# Altium schematic sheet Heater_ADC.SchDoc
size OrCAD A
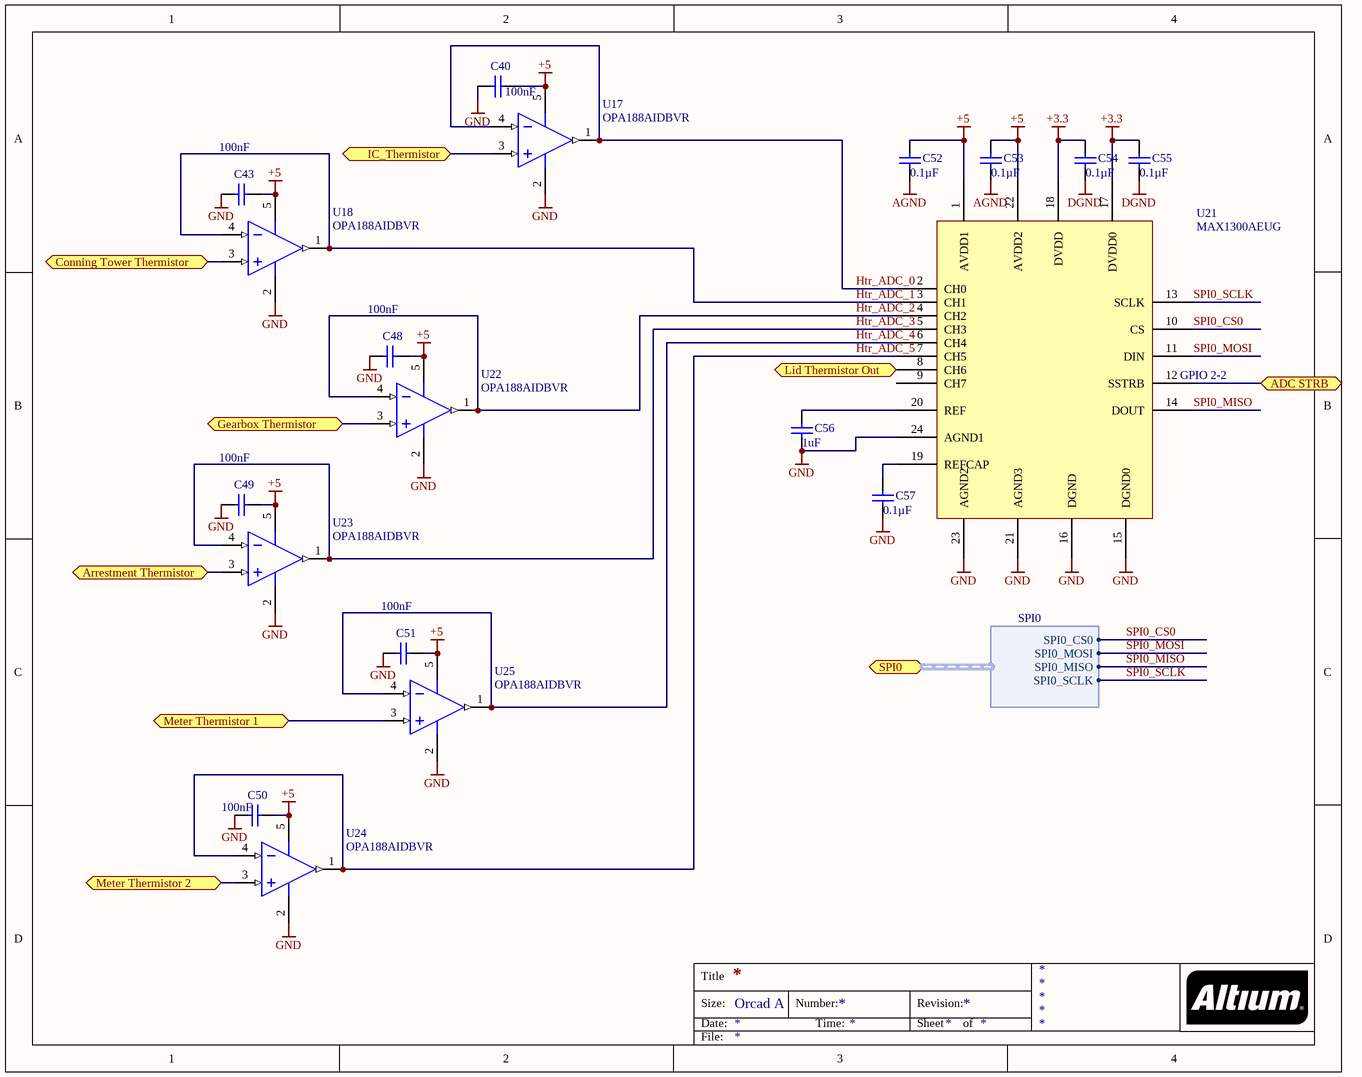
[diagram p0: Heater_ADC.SchDoc]

## Parts
C40  Capacitance: 100nF  [CAPC0402(1005)60_L]
C43  Capacitance: 100nF  [CAPC0402(1005)60_L]
C48  Capacitance: 100nF  [CAPC0402(1005)60_L]
C49  Capacitance: 100nF  [CAPC0402(1005)60_L]
C50  Capacitance: 100nF  [CAPC0402(1005)60_L]
C51  Capacitance: 100nF  [CAPC0402(1005)60_L]
C52  Capacitance: 0.1µF  [CAPC0805(2012)145_N]  (hidden comment: CAP CER 0.1UF 25V X7R 0805)
C53  Capacitance: 0.1µF  [CAPC0805(2012)145_N]  (hidden comment: CAP CER 0.1UF 25V X7R 0805)
C54  Capacitance: 0.1µF  [CAPC0805(2012)145_N]  (hidden comment: CAP CER 0.1UF 25V X7R 0805)
C55  Capacitance: 0.1µF  [CAPC0805(2012)145_N]  (hidden comment: CAP CER 0.1UF 25V X7R 0805)
C56  Capacitance: 1uF  [CAPC0805(2012)145_N]  (hidden comment: CAP CER 1UF 16V X7R 0805)
C57  Capacitance: 0.1µF  [CAPC0805(2012)145_N]  (hidden comment: CAP CER 0.1UF 16V X7R 0805)
U17  OPA188AIDBVR  [DBV0005A_M]
U18  OPA188AIDBVR  [DBV0005A_M]
U21  MAX1300AEUG  [TSOP65P640X90-24N]
U22  OPA188AIDBVR  [DBV0005A_M]
U23  OPA188AIDBVR  [DBV0005A_M]
U24  OPA188AIDBVR  [DBV0005A_M]
U25  OPA188AIDBVR  [DBV0005A_M]

## Ports
ADC STRB, Arrestment Thermistor, Conning Tower Thermistor, Gearbox Thermistor, IC_Thermistor, Lid Thermistor Out, Meter Thermistor 1, Meter Thermistor 2, SPI0 (harness SPI0)

## Harnesses
SPI0: SPI0_CS0, SPI0_MOSI, SPI0_MISO, SPI0_SCLK

## Nets
+3.3: C54.1 C55.1 U21.17(DVDD0) U21.18(DVDD)
+5: C40.2 C43.2 C48.2 C49.2 C50.2 C51.2 C52.1 C53.1 U17.5(V+) U18.5(V+) U21.1(AVDD1) U21.22(AVDD2) U22.5(V+) U23.5(V+) U24.5(V+) U25.5(V+)
AGND: C52.2 C53.2
DGND: C54.2 C55.2
GND: C40.1 C43.1 C48.1 C49.1 C50.1 C51.1 C56.2 C57.2 U17.2(V-) U18.2(V-) U21.15(DGND0) U21.16(DGND) U21.21(AGND3) U21.23(AGND2) U21.24(AGND1) U22.2(V-) U23.2(V-) U24.2(V-) U25.2(V-)
ADC STRB: U21.12(SSTRB) ; port ADC STRB
Arrestment Thermistor: U23.3(IN+) ; port Arrestment Thermistor
Conning Tower Thermistor: U18.3(IN+) ; port Conning Tower Thermistor
Gearbox Thermistor: U22.3(IN+) ; port Gearbox Thermistor
Htr_ADC_0: U17.1(OUT) U17.4(IN-) U21.2(CH0)
Htr_ADC_1: U18.1(OUT) U18.4(IN-) U21.3(CH1)
Htr_ADC_2: U21.4(CH2) U22.1(OUT) U22.4(IN-)
Htr_ADC_3: U21.5(CH3) U23.1(OUT) U23.4(IN-)
Htr_ADC_4: U21.6(CH4) U25.1(OUT) U25.4(IN-)
Htr_ADC_5: U21.7(CH5) U24.1(OUT) U24.4(IN-)
IC_Thermistor: U17.3(IN+) ; port IC_Thermistor
Lid Thermistor Out: U21.8(CH6) ; port Lid Thermistor Out
Meter Thermistor 1: U25.3(IN+) ; port Meter Thermistor 1
Meter Thermistor 2: U24.3(IN+) ; port Meter Thermistor 2
SPI0_CS0: U21.10(CS) ; port SPI0.SPI0_CS0
SPI0_MISO: U21.14(DOUT) ; port SPI0.SPI0_MISO
SPI0_MOSI: U21.11(DIN) ; port SPI0.SPI0_MOSI
SPI0_SCLK: U21.13(SCLK) ; port SPI0.SPI0_SCLK
NetC56_1: C56.1 U21.20(REF)
NetC57_1: C57.1 U21.19(REFCAP)

Not connected (* = marked no-connect by the designer): U21 9(CH7)

## Notes on the sheet
- (near U21) GPIO 2-2
- Title
- Size:
- Date:
- Orcad A
- Number:
- Time:
- Revision:
- Sheet
- of
- File:

## Library data of the parts
C40 C43 C48-C51 = CMP-1034-01343-1: Manufacturer: Kemet; Manufacturer Part Number: C0402C104K4RACAUTO; Dielectric Material: Ceramic; Tolerance: 10%; Voltage Rating: 16V; Dielectric: X7R; Dissipation Factor: 3.5%; Supplier 1: Mouser; Supplier Part Number 1: 80-C0402C104K4RAUTO; Stock 1: 120173; Pricing 1: 1=0.1, 10=0.07, 50=0.07, 100=0.07, 1000=0.059, 10000=0.042 (USD); Mount: Surface Mount; Case/Package: 0402; Case Code (Imperial): 0402; Case Code (Metric): 1005; Min Operating Temperature: -55°C; Max Operating Temperature: 125°C; Packaging: Tape and Reel; Package Quantity: 10000; Voltage Rating (DC): 16V; Termination: SMD/SMT; Length: 1mm; Height: 0.5mm; Width: 0.5mm; Thickness: 0.022inch; Depth: 0.5mm; Radiation Hardening: No; REACH SVHC: No SVHC; ComponentLink1URL: https://datasheet.ciiva.com/6254/datasheetpn-c0402c104k4racauto-6254625.pdf; ComponentLink1Description: https://datasheet.ciiva.com/6254/datasheetpn-c0402c104k4racauto-6254625.pdf; ComponentLink2URL: https://datasheet.ciiva.com/5999/1730444-5999370.pdf; ComponentLink2Description: https://datasheet.ciiva.com/5999/1730444-5999370.pdf; ComponentLink3URL: https://datasheet.ciiva.com/7747/1730444-7747437.pdf; ComponentLink3Description: https://datasheet.ciiva.com/7747/1730444-7747437.pdf; ComponentLink4URL: https://datasheet.ciiva.com/22693/1730444-22693870.pdf; ComponentLink4Description: https://datasheet.ciiva.com/22693/1730444-22693870.pdf
C52-C55 = CMP-1036-04795-1: Manufacturer: Murata Electronics North America; Manufacturer Part Number: GRM21BR71E104KA01L; Tolerance: ±10%; Supplier 1: Digi-Key; Supplier Part Number 1: 490-1673-6-ND; RoHS: RoHS Compliant; Category: Capacitors; Stock 1: 891652; Pricing 1: 1=0.2, 10=0.145, 100=0.0683, 500=0.04788, 1000=0.03964 (USD); Packaging: Digi-Reel®; Part Status: Active; Voltage - Rated: 25V; Temperature Coefficient: X7R; Operating Temperature: -55°C ~ 125°C; Features: -; Ratings: -; Applications: General Purpose; Mounting Type: Surface Mount, MLCC; Package / Case: 0805 (2012 Metric); Size / Dimension: 0.079" L x 0.049" W (2.00mm x 1.25mm); Height - Seated (Max): -; Thickness (Max): 0.053" (1.35mm); Lead Spacing: -; Lead Style: -; ComponentLink1URL: http://www.murata.com/~/media/webrenewal/support/library/catalog/products/capacitor/mlcc/c02e.ashx; ComponentLink1Description: http://www.murata.com/~/media/webrenewal/support/library/catalog/products/capacitor/mlcc/c02e.ashx
C56 = CMP-1036-04795-1: Manufacturer: Kemet; Manufacturer Part Number: C0805X105K4RACTU; Dielectric Material: Ceramic; Tolerance: 10%; Dissipation Factor: 3.5%; Supplier 1: Digi-Key; Supplier Part Number 1: 399-5329-1-ND; Stock 1: 12821; Pricing 1: 1=0.72, 10=0.528, 100=0.3623, 500=0.2868, 1000=0.2415 (USD); Mount: Surface Mount; Case/Package: 0805; Case Code (Imperial): 0805; Case Code (Metric): 2012; Min Operating Temperature: -55°C; Max Operating Temperature: 125°C; Packaging: Tape and Reel; Voltage Rating (DC): 16V; Package Quantity: 1; Voltage Rating: 16V; Dielectric: X7R; Termination: SMD/SMT; Voltage: 16V; Length: 2.1mm; Height: 0.9mm; Width: 1.25mm; Thickness: 0.039inch; Depth: 1.25mm; Radiation Hardening: No; REACH SVHC: No SVHC; ComponentLink1URL: https://datasheet.ciiva.com/7842/1698763-7842475.pdf; ComponentLink1Description: https://datasheet.ciiva.com/7842/1698763-7842475.pdf; ComponentLink2URL: https://datasheet.ciiva.com/7842/1698763-7842476.pdf; ComponentLink2Description: https://datasheet.ciiva.com/7842/1698763-7842476.pdf; ComponentLink3URL: https://datasheet.ciiva.com/14593/70096394-14593295.pdf; ComponentLink3Description: https://datasheet.ciiva.com/14593/70096394-14593295.pdf
C57 = CMP-1036-04795-1: Manufacturer: Murata Electronics North America; Manufacturer Part Number: GRM219R71C104KA01D; Tolerance: ±10%; Voltage - Rated: 25V; Supplier Part Number 1: 490-1673-6-ND; Temperature Coefficient: X7R; Thickness (Max): 0.053" (1.35mm); Supplier 2: Digi-Key; Supplier Part Number 2: 490-1683-6-ND; RoHS: RoHS Compliant; Category: Capacitors; Stock 2: 245331; Pricing 2: 1=0.14, 10=0.098, 100=0.0462, 500=0.0324, 1000=0.02683 (USD); Packaging: Digi-Reel®; Part Status: Active; Operating Temperature: -55°C ~ 125°C; Features: -; Ratings: -; Applications: General Purpose; Mounting Type: Surface Mount, MLCC; Package / Case: 0805 (2012 Metric); Size / Dimension: 0.079" L x 0.049" W (2.00mm x 1.25mm); Height - Seated (Max): -; Lead Spacing: -; Lead Style: -; ComponentLink1URL: http://www.murata.com/~/media/webrenewal/support/library/catalog/products/capacitor/mlcc/c02e.ashx; ComponentLink1Description: http://www.murata.com/~/media/webrenewal/support/library/catalog/products/capacitor/mlcc/c02e.ashx
U17 U18 U22-U25 = CMP-0809-00005-2: Precision, Low Noise, Rail-to-Rail Output, Zero-Drift Operational Amplifier, 4 to 36 V, -40 to 125 degC, 5-pin SOT23 (DBV5), Green (RoHS & no Sb/Br); Manufacturer: Texas Instruments; Total Supply Voltage(Min)(+5V is 5, +/-5V is 10): 4; Offset Drift(Typ)(uV/C): 0.03; Rating: Catalog; SubFamily: Zero Drift Precision Amplifier; GBW(Typ)(MHz): 2; Slew Rate(Typ)(V/us): 0.8; Number of Channels: 1; CMRR(Min)(dB): 120; Iq per channel(Max)(mA): 0.51; Total Supply Voltage(Max)(+5V is 5, +/-5V is 10): 36; PartNumber: OPA188AIDBVR; ComponentLink2Description: Datasheet; ComponentLink2URL: http://www.ti.com/lit/ds/symlink/opa188.pdf; ComponentLink1Description: Manufacturer URL; Mounting Technology: Surface Mount; Eco-Plan: Green (RoHS & no Sb/Br); ComponentLink1URL: http://www.ti.com/; PackageVersion: 4073253-4/K, 03/2006; DatasheetVersion: SBOS642A; ComponentLink3Description: Package Specification; PackageReference: DBV0005A; ComponentLink3URL: http://www.ti.com/litv/pdf/mpds018i; PackageDescription: 5-Pin Plastic Small Outline, Body 1.6 x 2.9 mm, Pitch 0.95 mm; Code_JEDEC: MO-178
U21 = MAX1300AEUG: IC ADC 16BIT SRL 115KSPS 24TSSOP; Manufacturer 1: Maxim Integrated; Manufacturer Part Number 1: MAX1300AEUG+; Category 1: Integrated Circuits (ICs); Number of Bits: 16; Sampling Rate (Per Second): 115k; Number of Inputs: 4, 8; Input Type: Differential, Single Ended; Data Interface: SPI; Configuration: MUX-PGA-S/H-ADC; Ratio - S/H:ADC: 1:1; Number of A/D Converters: 1; Architecture: SAR; Reference Type: External, Internal; Voltage - Supply, Analog: 5V; Supplier 2: Mouser; Supplier Part Number 2: 700-MAX1300AEUG+; Supplier 1: Digi-Key; Supplier Part Number 1: MAX1300AEUG+-ND; RoHS 1: RoHS Compliant; Description 1: IC ADC 16BIT SRL 115KSPS 24TSSOP; Stock 1: 1553; Pricing 1: 1=13.94, 10=13.24, 50=13.16 (USD); Packaging: Tube; Part Status: Active; Voltage - Supply, Digital: 5V; Features: PGA; Operating Temperature: -40°C ~ 85°C; Package / Case: 24-TSSOP (0.173", 4.40mm Width); Supplier Device Package: 24-TSSOP; ComponentLink1URL: http://datasheets.maximintegrated.com/en/ds/MAX1300-MAX1301.pdf; ComponentLink1Description: http://datasheets.maximintegrated.com/en/ds/MAX1300-MAX1301.pdf